# EAGLE schematic sensor_board_v4 (EAGLE 7.5.0)
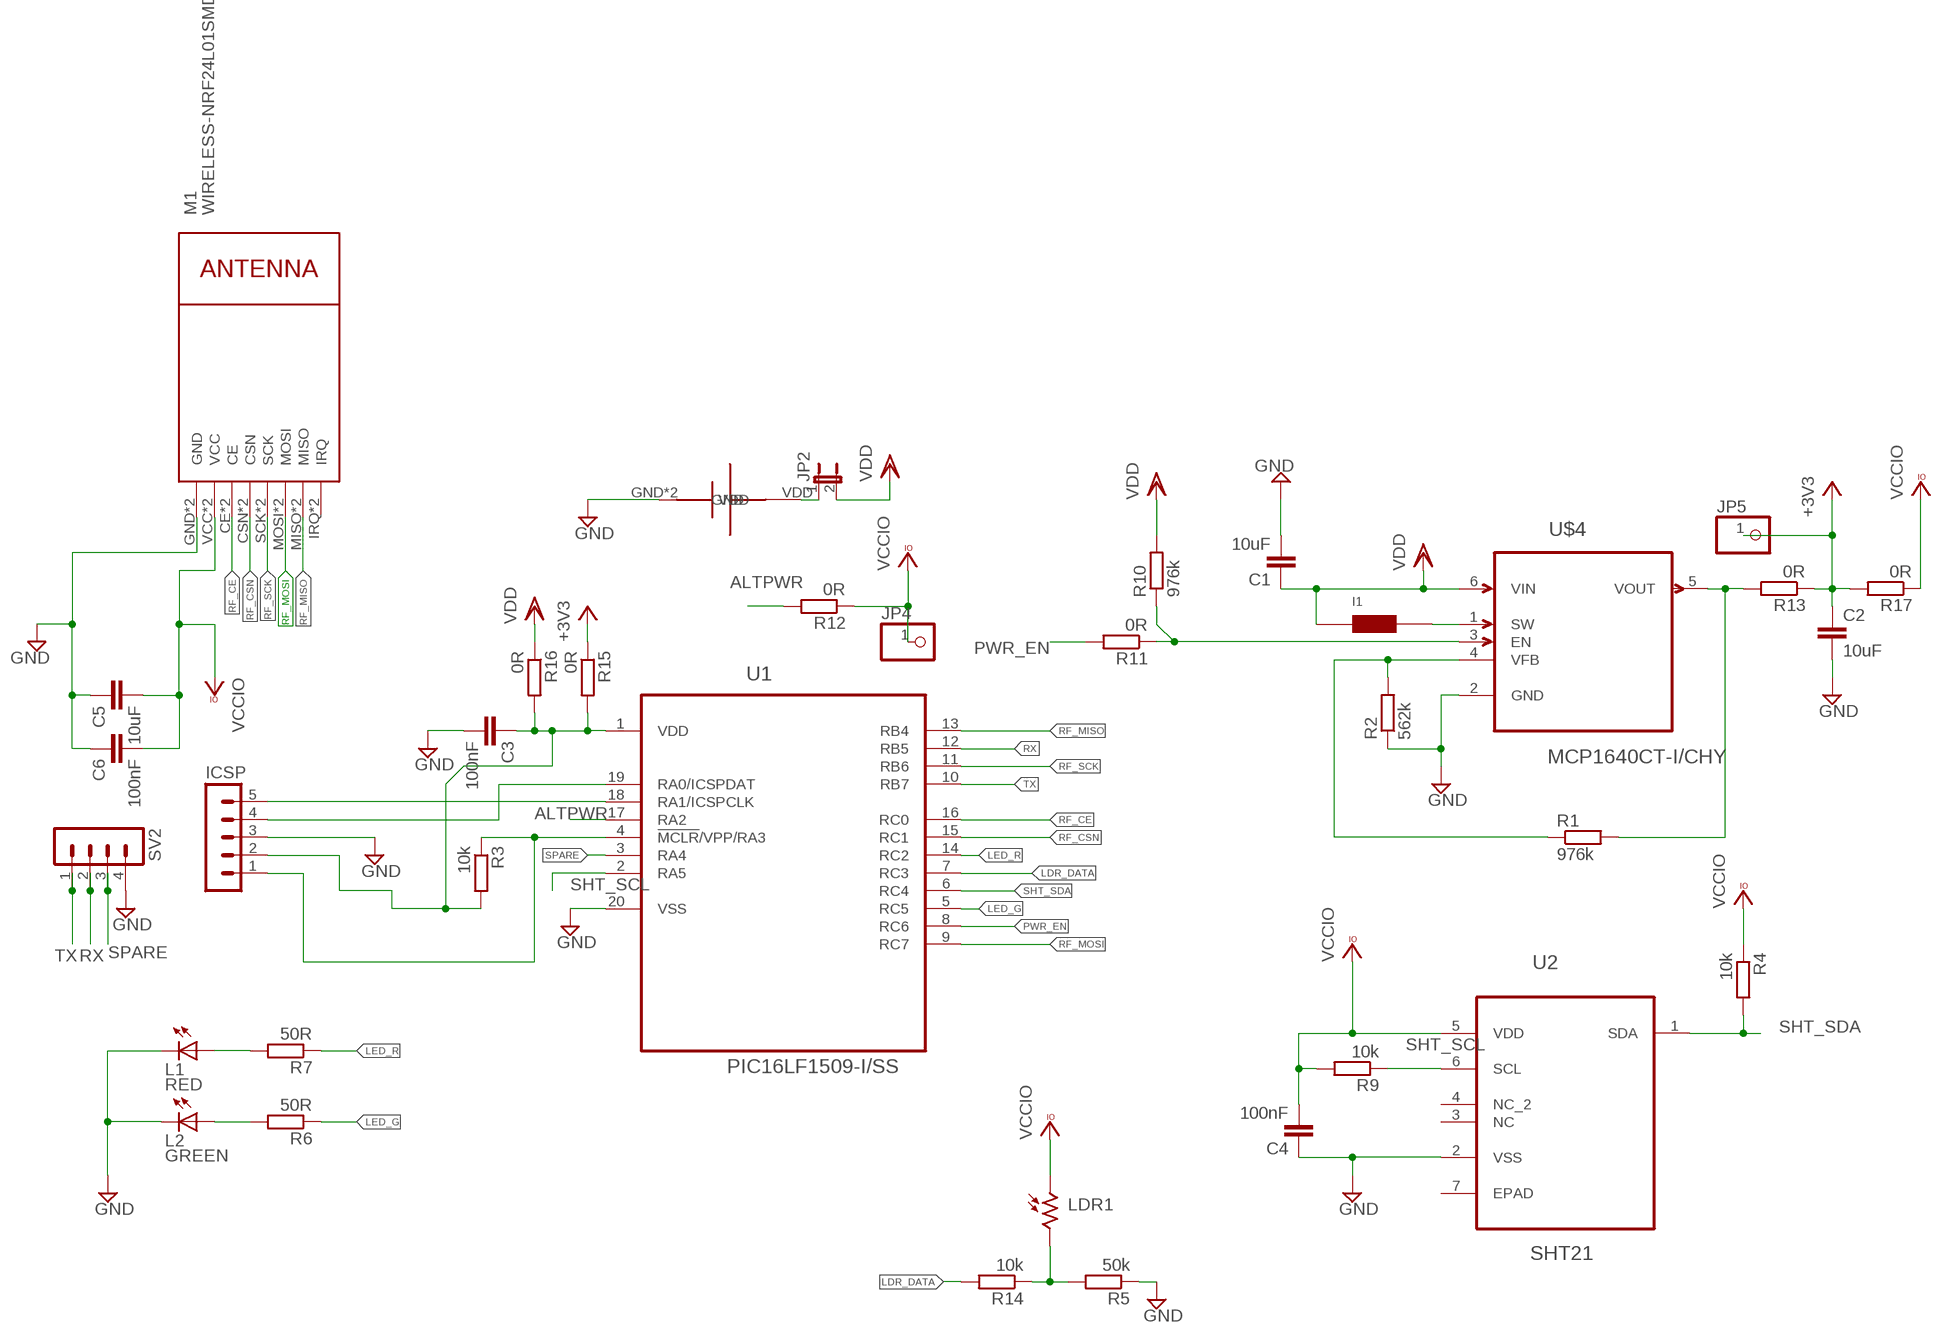
[diagram p0: schematic, sheet 1]

## Parts
C1  10uF  C-EUC0805  [C0805]
C2  10uF  C-EUC0805  [C0805]
C3  100nF  C-EUC0805  [C0805]
C4  100nF  C-EUC0805  [C0805]
C5  10uF  C-EUC0805  [C0805]
C6  100nF  C-EUC0805  [C0805]
I1  EPL2014-472MLB  [EPL2014]
ICSP  MA05-1  [MA05-1]
JP2  JP1E  [JP1]
JP4  PINHD-1X1  [1X01]
JP5  PINHD-1X1  [1X01]
L1  RED  LEDCHIPLED_0805  [CHIPLED_0805]
L2  GREEN  LEDCHIPLED_0805  [CHIPLED_0805]
LDR1  LDR  [LDR]
M1  WIRELESS-NRF24L01SMD  [NRF24L01-SMD]
R1  976k  R-EU_R0805  [R0805]
R2  562k  R-EU_R0805  [R0805]
R3  10k  R-EU_R0805  [R0805]
R4  10k  R-EU_R0805  [R0805]
R5  50k  R-EU_R0805  [R0805]
R6  50R  R-EU_R0805  [R0805]
R7  50R  R-EU_R0805  [R0805]
R9  10k  R-EU_R0805  [R0805]
R10  976k  R-EU_R0805  [R0805]
R11  0R  R-EU_R0805  [R0805]
R12  0R  R-EU_R0805  [R0805]
R13  0R  R-EU_R0805  [R0805]
R14  10k  R-EU_R0805  [R0805]
R15  0R  R-EU_R0805  [R0805]
R16  0R  R-EU_R0805  [R0805]
R17  0R  R-EU_R0805  [R0805]
SV2  MA04-1  [MA04-1]
U1  PIC16LF1509-I/SS  [SOP65P780X200-20N]
U2  SHT21  [DFN300X300X110-7N]
U$2  BATTAAA  [BATT]
U$4  MCP1640CT-I/CHY  [SOT95P270X145-6N]

## Nets
+3V3: C2.1 JP5.1 R13.1 R15.1 R17.2
ALTPWR: R12.2 U1.17(RA2)
GND: C1.2 C2.2 C3.2 C4.1 C5.1 C6.1 ICSP.3 L1.C L2.C M1.GND M1.GND1(GND) R2.1 R5.1 SV2.4 U1.20(VSS) U2.2(VSS) U$2.GND U$2.GND1(GND) U$4.2(GND)
LDR_DATA: R14.2 U1.7(RC3)
LED_G: R6.1 U1.5(RC5)
LED_R: R7.1 U1.14(RC2)
N$1: I1.2(PC2) U$4.1(SW)
N$2: R1.1 R2.2 U$4.4(VFB)
N$3: JP2.1 U$2.VDD
N$4: R10.1 R11.1 U$4.3(EN)
N$5: ICSP.4 U1.19(RA0/ICSPDAT)
N$6: L2.A R6.2
N$7: L1.A R7.2
N$8: ICSP.5 U1.18(RA1/ICSPCLK)
N$9: ICSP.1 R3.1 U1.4(!MCLR!/VPP/RA3)
N$10: C3.1 ICSP.2 R3.2 R15.2 R16.2 U1.1(VDD)
N$11: LDR1.2 R5.2 R14.1
N$13: R1.2 R13.2 U$4.5(VOUT)
PWR_EN: R11.2 U1.8(RC6)
RF_CE: M1.CE M1.CE1(CE) U1.16(RC0)
RF_CSN: M1.CSN M1.CSN1(CSN) U1.15(RC1)
RF_MISO: M1.MISO M1.MISO1(MISO) U1.13(RB4)
RF_MOSI: M1.MOSI M1.MOSI1(MOSI) U1.9(RC7)
RF_SCK: M1.SCK M1.SCK1(SCK) U1.11(RB6)
RX: SV2.2 U1.12(RB5)
SHT_SCL: R9.1 U1.2(RA5) U2.6(SCL)
SHT_SDA: R4.2 U1.6(RC4) U2.1(SDA)
SPARE: SV2.3 U1.3(RA4)
TX: SV2.1 U1.10(RB7)
VCCIO: C4.2 C5.2 C6.2 JP4.1 LDR1.1 M1.VCC M1.VCC1(VCC) R4.1 R9.2 R12.1 R17.1 U2.5(VDD)
VDD: C1.1 I1.1(PC1) JP2.2 R10.2 R16.1 U$4.6(VIN)
Unconnected: M1.IRQ M1.IRQ1(IRQ) U2.3(NC) U2.4(NC_2) U2.7(EPAD)

## Library data of the parts
C1-C6 = resistor:C-EU: CAPACITOR, European symbol
I1 = user:EPL2014-472MLB
ICSP = con-lstb:MA05-1: PIN HEADER; OC_FARNELL: unknown; OC_NEWARK: unknown
JP2 = jumper:JP1E: JUMPER
JP4 JP5 = pinhead:PINHD-1X1: PIN HEADER
L1 L2 = led:LED: LED OSRAM: - CHIPLED LG R971, LG N971, LY N971, LG Q971, LY Q971, LO R971, LY R971 LH N974, LH R974 LS Q976, LO Q976, LY Q976 LO Q996 - Hyper CHIPLED LW Q18S LB Q993, LB Q99A, LB R99A - SideLED LS A670, LO A670, LY A670, LG A670, LP A670 LB A673, LV A673, LT A673, LW A673 LH A674 LY A675 LS A676, LA A676, LO A676, LY A676, LW A676 LS A679, LY A679, LG A679 - Hyper Micro SIDELED® LS Y876, LA Y876, LO Y876, LY Y876 LT Y87S - SmartLED LW L88C, LW L88S LB L89C, LB L89S, LG L890 LS L89K, LO L89K, LY L89K LS L896, LA L896, LO L896, LY L896 - TOPLED LS T670, LO T670, LY T670, LG T670, LP T670 LSG T670, LSP T670, LSY T670, LOP T670, LYG T670 LG T671, LOG T671, LSG T671 LB T673, LV T673, LT T673, LW T673 LH T674 LS T676, LA T676, LO T676, LY T676, LB T676, LH T676, LSB T676, LW T676 LB T67C, LV T67C, LT T67C, LS T67K, LO T67K, LY T67K, LW E67C LS E67B, LA E67B, LO E67B, LY E67B, LB E67C, LV E67C, LT E67C LW T67C LS T679, LY T679, LG T679 LS T770, LO T770, LY T770, LG T770, LP T770 LB T773, LV T773, LT T773, LW T773 LH T774 LS E675, LA E675, LY E675, LS T675 LS T776, LA T776, LO T776, LY T776, LB T776 LHGB T686 LT T68C, LB T68C - Hyper Mini TOPLED® LB M676 - Mini TOPLED Santana® LG M470 LS M47K, LO M47K, LY M47K Source: http://www.osram.convergy.de LUXEON: - LUMILED® LXK2-PW12-R00, LXK2-PW12-S00, LXK2-PW14-U00, LXK2-PW14-V00 LXK2-PM12-R00, LXK2-PM12-S00, LXK2-PM14-U00 LXK2-PE12-Q00, LXK2-PE12-R00, LXK2-PE12-S00, LXK2-PE14-T00, LXK2-PE14-U00 LXK2-PB12-K00, LXK2-PB12-L00, LXK2-PB12-M00, LXK2-PB14-N00, LXK2-PB14-P00, LXK2-PB14-Q00 LXK2-PR12-L00, LXK2-PR12-M00, LXK2-PR14-Q00, LXK2-PR14-R00 LXK2-PD12-Q00, LXK2-PD12-R00, LXK2-PD12-S00 LXK2-PH12-R00, LXK2-PH12-S00 LXK2-PL12-P00, LXK2-PL12-Q00, LXK2-PL12-R00 Source: www.luxeon.com KINGBRIGHT: KA-3528ASYC Source: www.kingbright.com
LDR1 = user:LDR
M1 = diy-modules:WIRELESS-NRF24L01: 2.4 GHz Wireless Module based on NRF24L01 chip
R1-R7 R9-R17 = resistor:R-EU_: RESISTOR, European symbol
SV2 = con-lstb:MA04-1: PIN HEADER; OC_FARNELL: unknown; OC_NEWARK: unknown
U1 = user:PIC16LF1509-I/SS: 20-Pin Flash, 8-Bit Microcontrollers,SSOP-20; MPN: PIC16LF1509-I/SS; OC_FARNELL: 2085029; OC_NEWARK: 64T1073; PACKAGE: SSOP-20; SUPPLIER: MICROCHIP
U2 = sht21:SHT21: SENSOR, HUMIDITY & TEMP; MPN: SHT21; OC_FARNELL: 1855468; OC_NEWARK: 20T1172; PACKAGE: DFN-6; SUPPLIER: SENSIRION
U$2 = batteryaaa:BATTAAA
U$4 = mcp1640:MCP1640CT-I/CHY: Synchronous Boost Regulator; MPN: MCP1640T-I/CHY; OC_FARNELL: 1800208; OC_NEWARK: 73R3626; PACKAGE: SOT-6; SUPPLIER: Microchip